# EAGLE design hcgs-midi-mud-led (EAGLE 8.6.0)
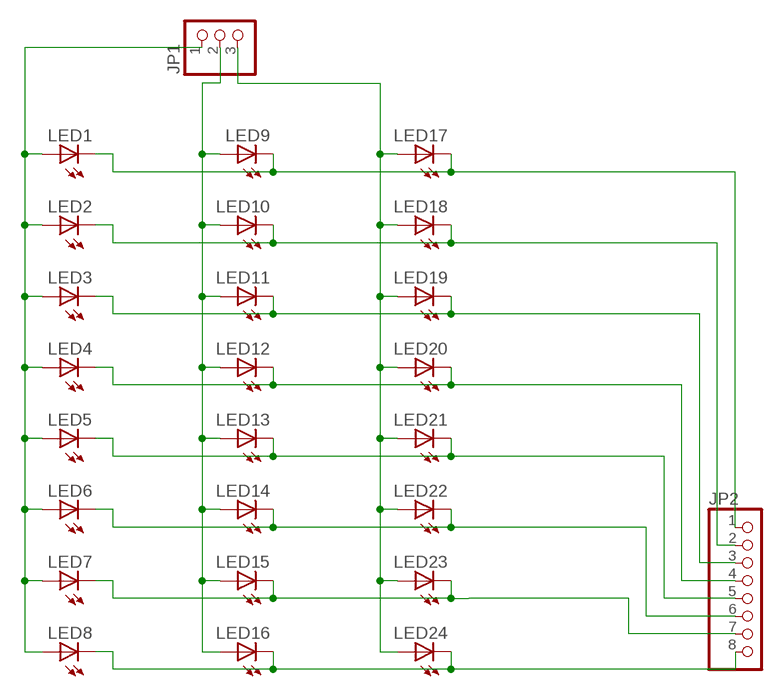
[diagram p0: schematic, sheet 1]

## Parts
JP1  PINHD-1X3  [1X03]
JP2  PINHD-1X8  [1X08]
LED1  LED5MM  [LED5MM]
LED2  LED5MM  [LED5MM]
LED3  LED5MM  [LED5MM]
LED4  LED5MM  [LED5MM]
LED5  LED5MM  [LED5MM]
LED6  LED5MM  [LED5MM]
LED7  LED5MM  [LED5MM]
LED8  LED5MM  [LED5MM]
LED9  LED5MM  [LED5MM]
LED10  LED5MM  [LED5MM]
LED11  LED5MM  [LED5MM]
LED12  LED5MM  [LED5MM]
LED13  LED5MM  [LED5MM]
LED14  LED5MM  [LED5MM]
LED15  LED5MM  [LED5MM]
LED16  LED5MM  [LED5MM]
LED17  LED5MM  [LED5MM]
LED18  LED5MM  [LED5MM]
LED19  LED5MM  [LED5MM]
LED20  LED5MM  [LED5MM]
LED21  LED5MM  [LED5MM]
LED22  LED5MM  [LED5MM]
LED23  LED5MM  [LED5MM]
LED24  LED5MM  [LED5MM]

## Nets
N$1: JP1.1 LED1.A LED2.A LED3.A LED4.A LED5.A LED6.A LED7.A LED8.A
N$2: JP1.2 LED9.A LED10.A LED11.A LED12.A LED13.A LED14.A LED15.A LED16.A
N$3: JP1.3 LED17.A LED18.A LED19.A LED20.A LED21.A LED22.A LED23.A LED24.A
N$4: JP2.1 LED1.K(C) LED9.K(C) LED17.K(C)
N$5: JP2.2 LED2.K(C) LED10.K(C) LED18.K(C)
N$6: JP2.3 LED3.K(C) LED11.K(C) LED19.K(C)
N$7: JP2.4 LED4.K(C) LED12.K(C) LED20.K(C)
N$8: JP2.5 LED5.K(C) LED13.K(C) LED21.K(C)
N$9: JP2.6 LED6.K(C) LED14.K(C) LED22.K(C)
N$10: JP2.7 LED7.K(C) LED15.K(C) LED23.K(C)
N$11: JP2.8 LED8.K(C) LED16.K(C) LED24.K(C)

## Library data of the parts
JP1 = pinhead:PINHD-1X3: PIN HEADER
JP2 = pinhead:PINHD-1X8: PIN HEADER
LED1-LED24 = adafruit:LED: LED OSRAM: - CHIPLED LG R971, LG N971, LY N971, LG Q971, LY Q971, LO R971, LY R971 LH N974, LH R974 LS Q976, LO Q976, LY Q976 LO Q996 - Hyper CHIPLED LW Q18S LB Q993, LB Q99A, LB R99A - SideLED LS A670, LO A670, LY A670, LG A670, LP A670 LB A673, LV A673, LT A673, LW A673 LH A674 LY A675 LS A676, LA A676, LO A676, LY A676, LW A676 LS A679, LY A679, LG A679 - Hyper Micro SIDELED® LS Y876, LA Y876, LO Y876, LY Y876 LT Y87S - SmartLED LW L88C, LW L88S LB L89C, LB L89S, LG L890 LS L89K, LO L89K, LY L89K LS L896, LA L896, LO L896, LY L896 - TOPLED LS T670, LO T670, LY T670, LG T670, LP T670 LSG T670, LSP T670, LSY T670, LOP T670, LYG T670 LG T671, LOG T671, LSG T671 LB T673, LV T673, LT T673, LW T673 LH T674 LS T676, LA T676, LO T676, LY T676, LB T676, LH T676, LSB T676, LW T676 LB T67C, LV T67C, LT T67C, LS T67K, LO T67K, LY T67K, LW E67C LS E67B, LA E67B, LO E67B, LY E67B, LB E67C, LV E67C, LT E67C LW T67C LS T679, LY T679, LG T679 LS T770, LO T770, LY T770, LG T770, LP T770 LB T773, LV T773, LT T773, LW T773 LH T774 LS E675, LA E675, LY E675, LS T675 LS T776, LA T776, LO T776, LY T776, LB T776 LHGB T686 LT T68C, LB T68C - Hyper Mini TOPLED® LB M676 - Mini TOPLED Santana® LG M470 LS M47K, LO M47K, LY M47K Source: http://www.osram.convergy.de/

## Board
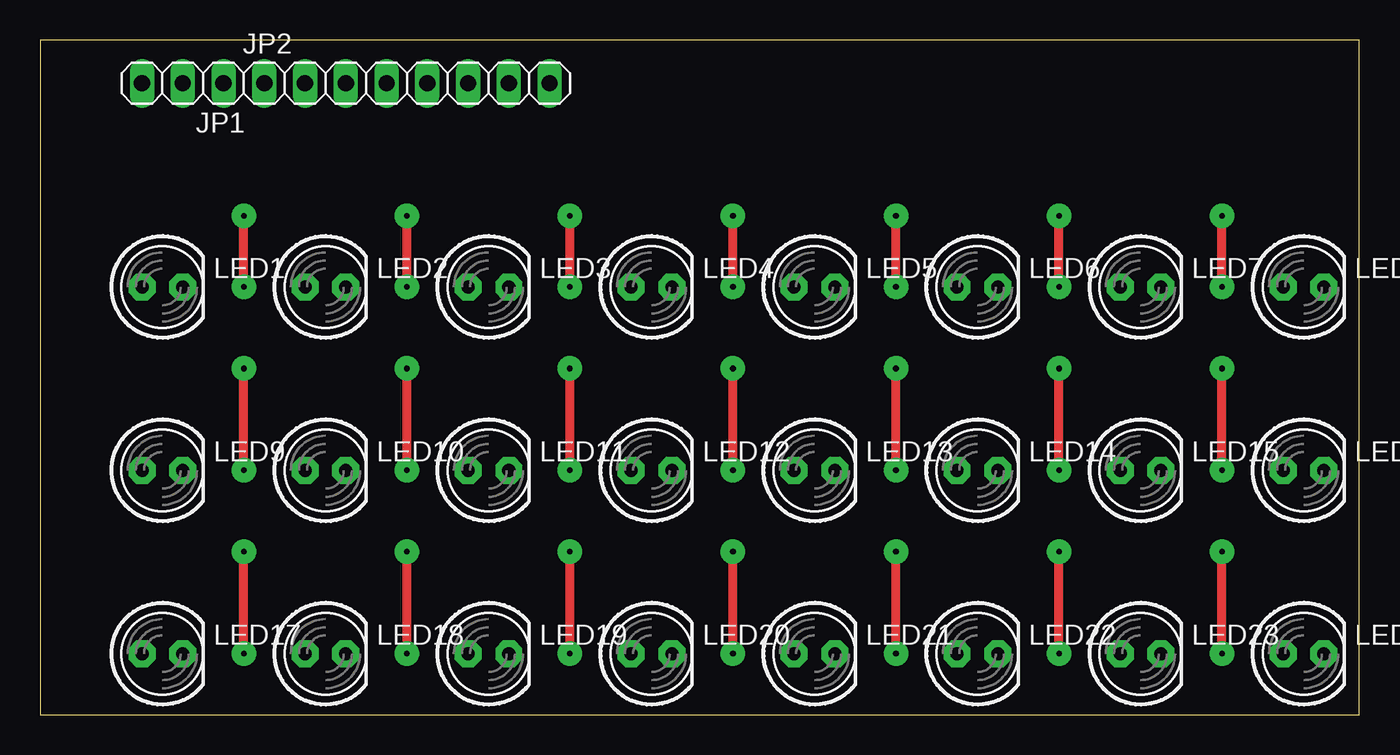
[diagram p1: board, top side]
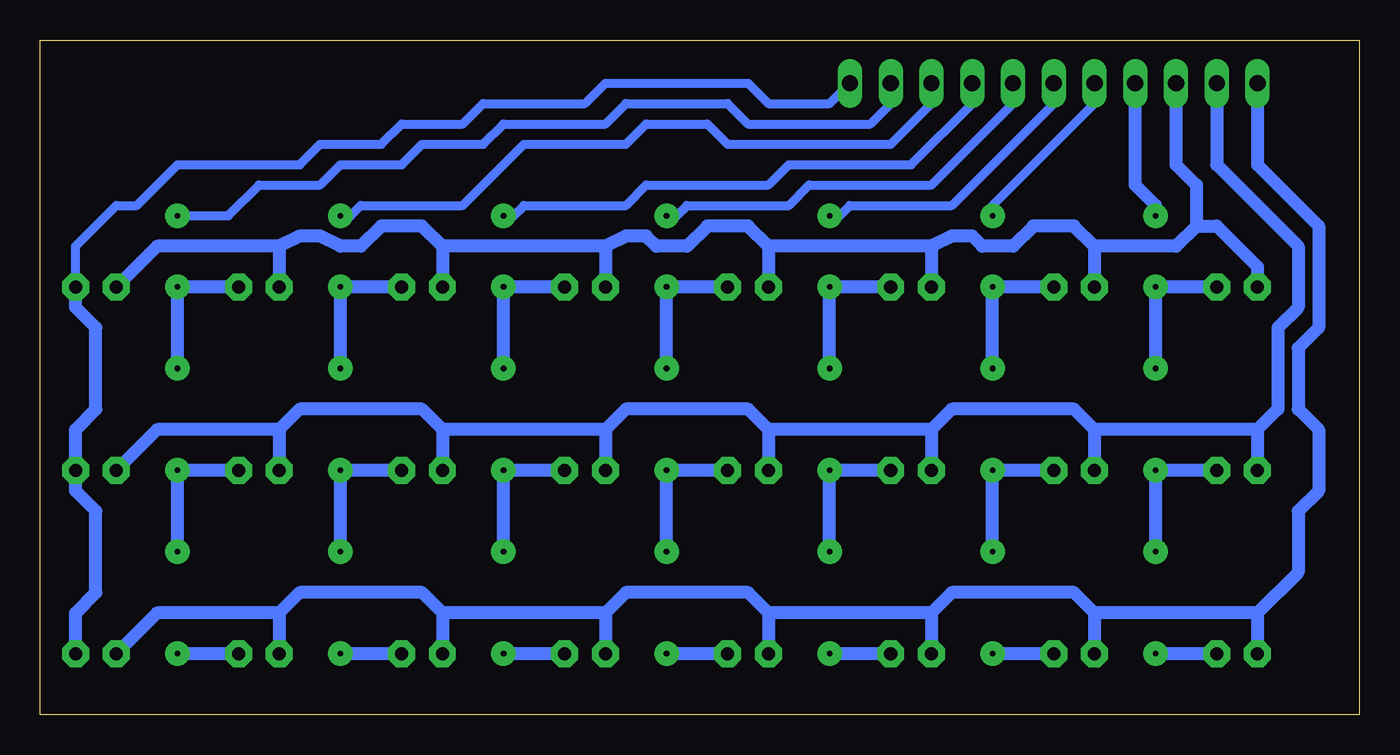
[diagram p2: board, bottom side, seen from below]

Size 82.22 x 42.06 mm. Coordinates in mm from the lower left corner, seen from the top.
Outline: 0,0 82.22,0 82.22,42.06 0,42.06 0,0
Copper layers (1*16): Top 0.035mm / dielectric 1.5mm / Bottom 0.035mm
Design rules "default": minimum track width 6mil, minimum drill 0.35mm, track to track 6mil, track to pad 6mil, pad to pad 6mil, via to via 6mil, smd to smd 6mil, copper to edge 40mil, drill to drill 6mil, minimum pad ring 10mil, minimum via ring 8mil, stop-mask expansion 4mil, vias tented up to drill 0mil, thermal gap 10mil

### Footprints (pad centres in the part's own frame; a part is rotated, then mirrored left to right if it is on the bottom)
1X03 = drill 1.016 long: 1 -2.54,0; 2 0,0; 3 2.54,0
1X08 = drill 1.016 long: 1 -8.89,0; 2 -6.35,0; 3 -3.81,0; 4 -1.27,0; 5 1.27,0; 6 3.81,0; 7 6.35,0; 8 8.89,0
LED5MM = drill 0.813 pad 1.676 octagon: A -1.27,0; K 1.27,0

### Placement (x,y rotation side)
JP1  8.89,39.37 180 top
JP2  22.86,39.37 0 top
LED1  7.62,26.67 0 top
LED2  17.78,26.67 0 top
LED3  27.94,26.67 0 top
LED4  38.1,26.67 0 top
LED5  48.26,26.67 0 top
LED6  58.42,26.67 0 top
LED7  68.58,26.67 0 top
LED8  78.74,26.67 0 top
LED9  7.62,15.24 0 top
LED10  17.78,15.24 0 top
LED11  27.94,15.24 0 top
LED12  38.1,15.24 0 top
LED13  48.26,15.24 0 top
LED14  58.42,15.24 0 top
LED15  68.58,15.24 0 top
LED16  78.74,15.24 0 top
LED17  7.62,3.81 0 top
LED18  17.78,3.81 0 top
LED19  27.94,3.81 0 top
LED20  38.1,3.81 0 top
LED21  48.26,3.81 0 top
LED22  58.42,3.81 0 top
LED23  68.58,3.81 0 top
LED24  78.74,3.81 0 top

### Tracks (layer width: path | path; a pad name or v marks a point on that pad's centre or on a via)
N$1
  Bottom 0.813: JP1.1 11.43,34.29 10.16,33.02 10.16,30.48 | 10.16,30.48 8.89,30.48 6.35,27.94 LED1.A | 10.16,30.48 11.43,29.21 16.51,29.21 | 16.51,29.21 17.78,30.48 20.32,30.48 21.59,29.21 23.5,29.21 24.13,29.84 25.4,29.84 26.67,29.21 | 26.67,29.21 36.83,29.21 | 36.83,29.21 38.1,30.48 40.64,30.48 41.91,29.21 43.81,29.21 44.45,29.84 45.72,29.84 46.99,29.21 | 46.99,29.21 57.15,29.21 | 57.15,29.21 58.42,30.48 60.96,30.48 62.23,29.21 63.5,29.21 64.77,29.84 66.04,29.84 67.31,29.21 | 67.31,29.21 74.93,29.21 LED8.A | 67.31,29.21 LED7.A | 57.15,29.21 LED6.A | 46.99,29.21 LED5.A | 36.83,29.21 LED4.A | 26.67,29.21 LED3.A | 16.51,29.21 LED2.A
N$2
  Bottom 0.813: JP1.2 8.89,34.29 3.81,29.21 3.81,25.4 5.08,24.13 5.08,19.05 6.35,17.78 | 6.35,17.78 LED9.A | 6.35,17.78 16.51,17.78 | 16.51,17.78 17.78,19.05 25.4,19.05 26.67,17.78 | 26.67,17.78 36.83,17.78 | 36.83,17.78 38.1,19.05 45.72,19.05 46.99,17.78 | 46.99,17.78 57.15,17.78 | 57.15,17.78 58.42,19.05 66.04,19.05 67.31,17.78 | 67.31,17.78 74.93,17.78 LED16.A | 67.31,17.78 LED15.A | 57.15,17.78 LED14.A | 46.99,17.78 LED13.A | 36.83,17.78 LED12.A | 26.67,17.78 LED11.A | 16.51,17.78 LED10.A
N$3
  Bottom 0.813: JP1.3 6.35,34.29 2.54,30.48 2.54,24.13 3.81,22.86 3.81,19.05 2.54,17.78 2.54,13.97 3.81,12.7 3.81,8.89 6.35,6.35 | 6.35,6.35 LED17.A | 6.35,6.35 16.51,6.35 | 16.51,6.35 17.78,7.62 25.4,7.62 26.67,6.35 | 26.67,6.35 36.83,6.35 | 36.83,6.35 38.1,7.62 45.72,7.62 46.99,6.35 | 46.99,6.35 57.15,6.35 | 57.15,6.35 58.42,7.62 66.04,7.62 67.31,6.35 | 67.31,6.35 74.93,6.35 LED24.A | 16.51,6.35 LED18.A | 26.67,6.35 LED19.A | 36.83,6.35 LED20.A | 46.99,6.35 LED21.A | 57.15,6.35 LED22.A | 67.31,6.35 LED23.A
N$4  (via drill 0.35 pad 1.52)
  Top 0.559: v12.7,3.81 v12.7,10.16 | v12.7,15.24 v12.7,21.59 | v12.7,26.67 v12.7,31.11
  Bottom 0.813: LED17.K v12.7,3.81 | v12.7,10.16 v12.7,15.24 LED9.K | v12.7,21.59 v12.7,26.67 LED1.K | v12.7,31.11 12.7,31.75 13.97,33.02 JP2.1
N$5  (via drill 0.35 pad 1.52)
  Top 0.559: v22.86,3.81 v22.86,10.16 | v22.86,15.24 v22.86,21.59 | v22.86,26.67 v22.86,31.11
  Bottom 0.559: v22.86,31.11 22.86,31.75 16.51,38.1 JP2.2
  Bottom 0.813: LED18.K v22.86,3.81 | v22.86,10.16 v22.86,15.24 LED10.K | v22.86,21.59 v22.86,26.67 LED2.K
N$6  (via drill 0.35 pad 1.52)
  Top 0.559: v33.02,3.81 v33.02,10.16 | v33.02,15.24 v33.02,21.59 | v33.02,26.67 v33.02,31.11
  Bottom 0.559: v33.02,31.11 32.38,31.11 31.75,31.75 25.4,31.75 19.05,38.1 JP2.3
  Bottom 0.813: LED19.K v33.02,3.81 | v33.02,10.16 v33.02,15.24 LED11.K | v33.02,21.59 v33.02,26.67 LED3.K
N$7  (via drill 0.35 pad 1.52)
  Top 0.559: v43.18,3.81 v43.18,10.16 | v43.18,15.24 v43.18,21.59 | v43.18,26.67 v43.18,31.11
  Bottom 0.559: v43.18,31.11 42.55,31.11 41.91,31.75 35.56,31.75 34.29,33.02 26.67,33.02 21.59,38.1 JP2.4
  Bottom 0.813: v43.18,10.16 v43.18,15.24 LED12.K | v43.18,21.59 v43.18,26.67 LED4.K | LED20.K v43.18,3.81
N$8  (via drill 0.35 pad 1.52)
  Top 0.559: v53.34,3.81 v53.34,10.16 | v53.34,15.24 v53.34,21.59 | v53.34,26.67 v53.34,31.11
  Bottom 0.559: v53.34,31.11 52.7,31.11 52.07,31.75 45.72,31.75 44.45,33.02 36.83,33.02 35.56,34.29 27.94,34.29 24.13,38.1 JP2.5
  Bottom 0.813: LED21.K v53.34,3.81 | v53.34,10.16 v53.34,15.24 LED13.K | v53.34,21.59 v53.34,26.67 LED5.K
N$9  (via drill 0.35 pad 1.52)
  Top 0.559: v63.5,3.81 v63.5,10.16 | v63.5,15.24 v63.5,21.59 | v63.5,26.67 v63.5,31.11
  Bottom 0.559: v63.5,31.11 62.87,31.11 62.23,31.75 55.88,31.75 52.07,35.56 45.72,35.56 44.45,36.83 40.64,36.83 39.37,35.56 29.21,35.56 26.67,38.1 JP2.6
  Bottom 0.813: LED22.K v63.5,3.81 | v63.5,10.16 v63.5,15.24 LED14.K | v63.5,21.59 v63.5,26.67 LED6.K
N$10  (via drill 0.35 pad 1.52)
  Top 0.559: v73.66,3.81 v73.66,10.16 | v73.66,15.24 v73.66,21.59 | v73.66,26.67 v73.66,31.11
  Bottom 0.559: v73.66,31.11 70.48,31.11 68.58,33.02 64.77,33.02 63.5,34.29 59.69,34.29 58.42,35.56 54.61,35.56 53.34,36.83 46.99,36.83 45.72,38.1 39.37,38.1 38.1,36.83 30.48,36.83 29.21,38.1 JP2.7
  Bottom 0.813: LED23.K v73.66,3.81 | v73.66,10.16 v73.66,15.24 LED15.K | v73.66,21.59 v73.66,26.67 LED7.K
N$11
  Bottom 0.559: LED8.K 80.01,29.21 77.47,31.75 76.2,31.75 73.66,34.29 66.04,34.29 64.77,35.56 60.96,35.56 59.69,36.83 55.88,36.83 54.61,38.1 48.26,38.1 46.99,39.37 38.1,39.37 36.83,38.1 33.02,38.1 JP2.8
  Bottom 0.813: LED24.K 80.01,6.35 78.74,7.62 78.74,12.7 80.01,13.97 LED16.K 80.01,17.78 78.74,19.05 78.74,24.13 80.01,25.4 LED8.K